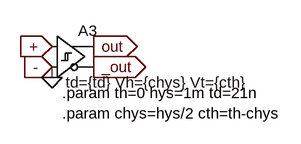
[diagram p0: schematic comp_hys-fall-fast.asc]
comp_hys-fall-fast.asc, the LTspice schematic file:
Version 4
SHEET 1 880 680
FLAG 224 160 out
IOPIN 224 160 Out
FLAG 224 192 _out
IOPIN 224 192 Out
FLAG 160 192 -
IOPIN 160 192 In
FLAG 160 160 +
IOPIN 160 160 In
FLAG 160 208 0
SYMBOL Digital\\diffschmitt 160 112 R0
WINDOW 3 21 104 Left 0
SYMATTR Value td={td} Vh={chys} Vt={cth}
SYMATTR InstName A3
TEXT 176 232 Left 0 !.param th=0 hys=1m td=21n\n.param chys=hys/2 cth=th-chys

The netlist it stands for:
* comp_hys-fall-fast.asc
A3 + - 0 0 0 _out out 0 SCHMITT td={td} Vh={chys} Vt={cth}
.param th=0 hys=1m td=21n
.param chys=hys/2 cth=th-chys
.backanno
.end